# Altium schematic sheet Sheet1.SchDoc
size A4
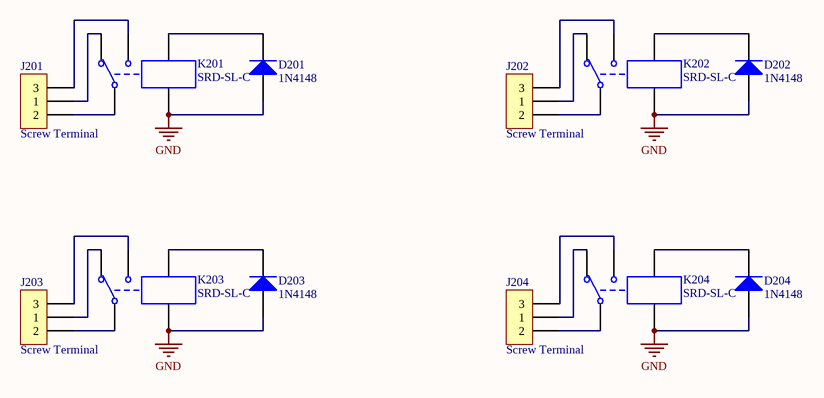
[diagram p0: Sheet1.SchDoc]

## Parts
D201  1N4148  [CD2012-0805]
D202  1N4148  [CD2012-0805]
D203  1N4148  [CD2012-0805]
D204  1N4148  [CD2012-0805]
J201  Screw Terminal  [3pin ST]
J202  Screw Terminal  [3pin ST]
J203  Screw Terminal  [3pin ST]
J204  Screw Terminal  [3pin ST]
K201  SRD-SL-C  [SRD-SL-C]
K202  SRD-SL-C  [SRD-SL-C]
K203  SRD-SL-C  [SRD-SL-C]
K204  SRD-SL-C  [SRD-SL-C]

## Nets
GND: D201.A D202.A D203.A D204.A K201.2 K202.2 K203.2 K204.2
NetD201_K: D201.K K201.1
NetD202_K: D202.K K202.1
NetD203_K: D203.K K203.1
NetD204_K: D204.K K204.1
NetJ201_1: J201.1 K201.5
NetJ201_2: J201.2 K201.3
NetJ201_3: J201.3 K201.4
NetJ202_1: J202.1 K202.5
NetJ202_2: J202.2 K202.3
NetJ202_3: J202.3 K202.4
NetJ203_1: J203.1 K203.5
NetJ203_2: J203.2 K203.3
NetJ203_3: J203.3 K203.4
NetJ204_1: J204.1 K204.5
NetJ204_2: J204.2 K204.3
NetJ204_3: J204.3 K204.4

## Library data of the parts
D201-D204 = Diode: Value: 1N4148
J201-J204 = 3 pin Screw Terminal: WR-TBL Terminal block - serie 102 - 5.0mm; ComponentLink2 Description: Datasheet; NoPins: 3; ComponentLink2URL: http://katalog.we-online.de/em/datasheet/6911027100xx.pdf
K201-K204 = Relay SRD-SL-C